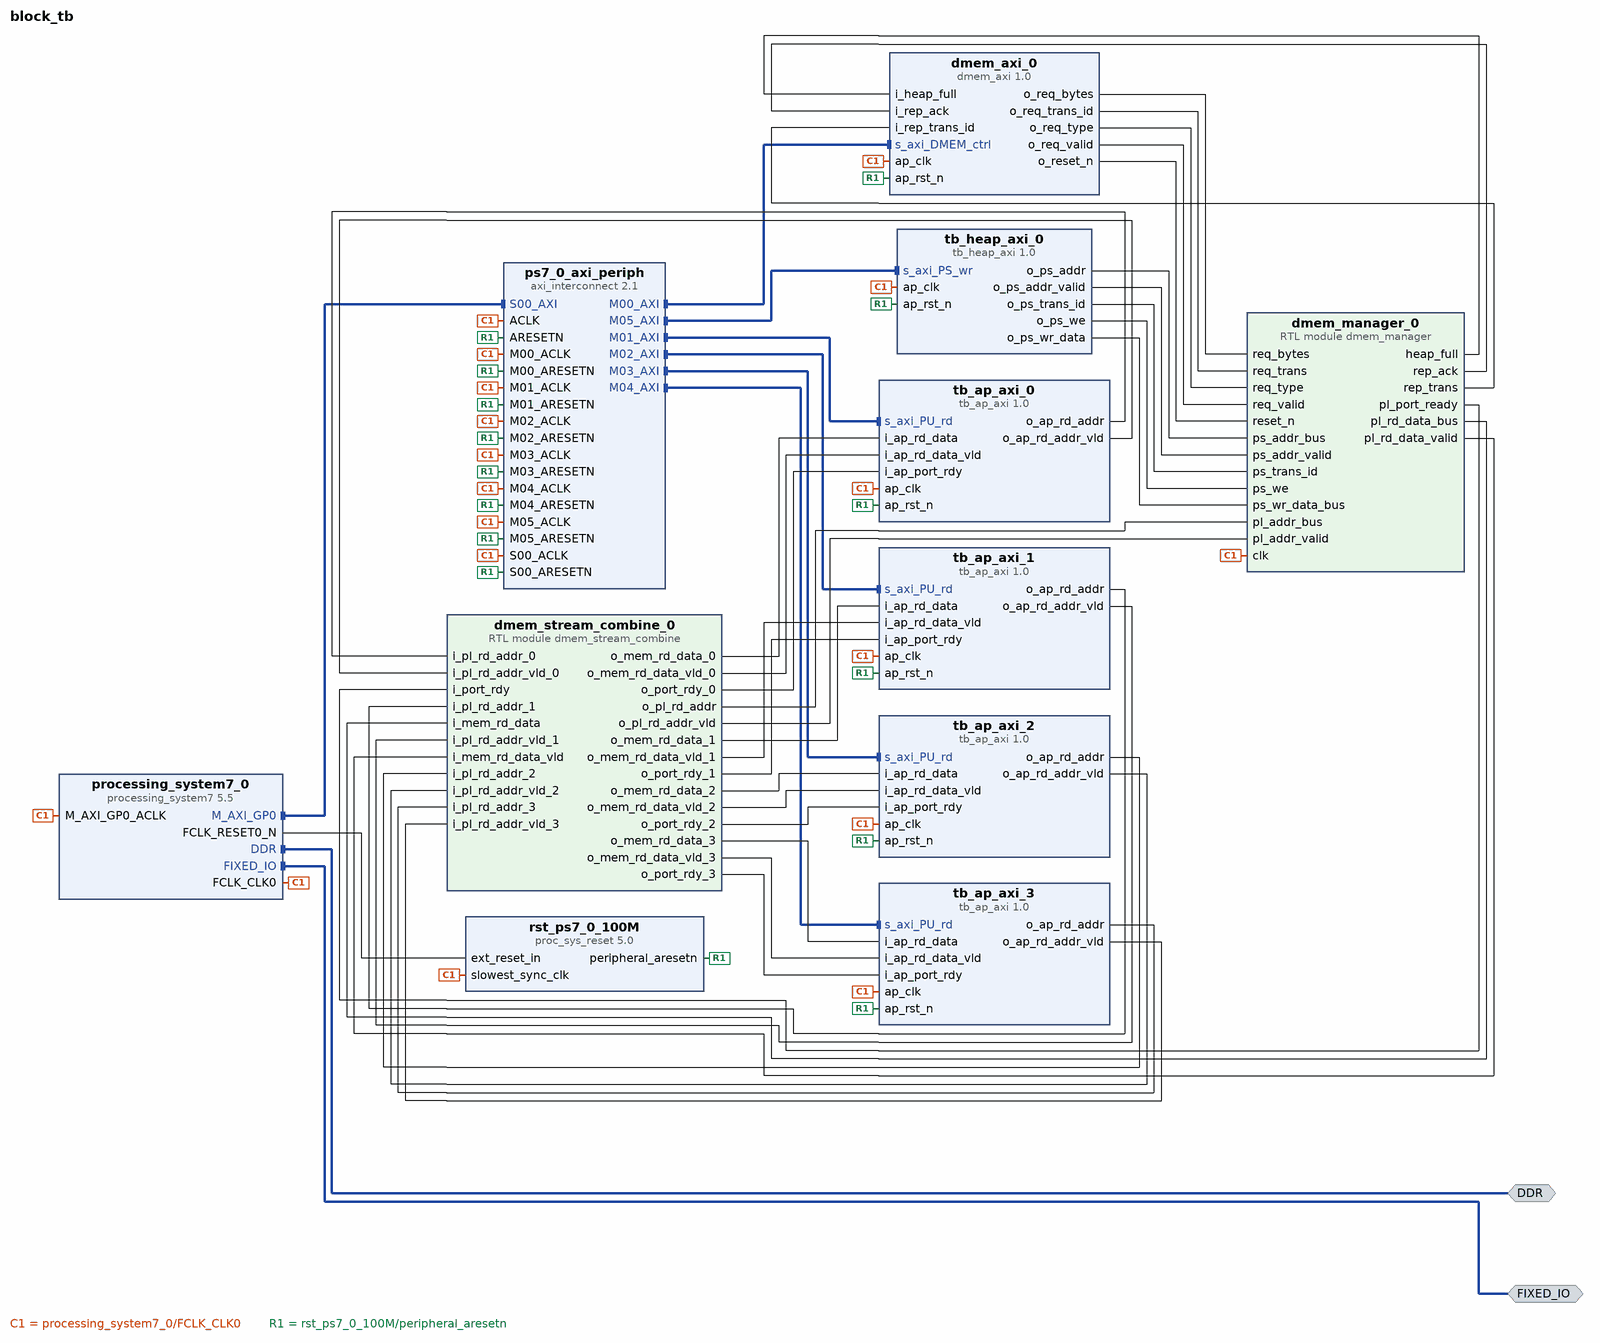
[diagram p0: block diagram of the top level]
# Vivado block design block_tb, xc7z020clg400-1, Vivado 2023.2
create_bd_design block_tb

create_bd_intf_port -mode Master -vlnv xilinx.com:interface:ddrx_rtl:1.0 DDR
create_bd_intf_port -mode Master -vlnv xilinx.com:display_processing_system7:fixedio_rtl:1.0 FIXED_IO

create_bd_cell -type module -reference dmem_manager dmem_manager_0
create_bd_cell -type ip -vlnv xilinx.com:hls:dmem_axi:1.0 dmem_axi_0
create_bd_cell -type ip -vlnv xilinx.com:hls:tb_heap_axi:1.0 tb_heap_axi_0
create_bd_cell -type module -reference dmem_stream_combine dmem_stream_combine_0
create_bd_cell -type ip -vlnv xilinx.com:hls:tb_ap_axi:1.0 tb_ap_axi_0
create_bd_cell -type ip -vlnv xilinx.com:hls:tb_ap_axi:1.0 tb_ap_axi_1
create_bd_cell -type ip -vlnv xilinx.com:hls:tb_ap_axi:1.0 tb_ap_axi_2
create_bd_cell -type ip -vlnv xilinx.com:hls:tb_ap_axi:1.0 tb_ap_axi_3
create_bd_cell -type ip -vlnv xilinx.com:ip:processing_system7:5.5 processing_system7_0
set_property -dict [list \
  CONFIG.PCW_APU_PERIPHERAL_FREQMHZ 650 \
  CONFIG.PCW_CRYSTAL_PERIPHERAL_FREQMHZ 50 \
  CONFIG.PCW_ENET0_ENET0_IO {MIO 16 .. 27} \
  CONFIG.PCW_ENET0_GRP_MDIO_ENABLE 1 \
  CONFIG.PCW_ENET0_GRP_MDIO_IO {MIO 52 .. 53} \
  CONFIG.PCW_ENET0_PERIPHERAL_ENABLE 1 \
  CONFIG.PCW_ENET0_RESET_ENABLE 1 \
  CONFIG.PCW_ENET0_RESET_IO {MIO 9} \
  CONFIG.PCW_ENET_RESET_ENABLE 1 \
  CONFIG.PCW_ENET_RESET_SELECT {Share reset pin} \
  CONFIG.PCW_FPGA0_PERIPHERAL_FREQMHZ 100 \
  CONFIG.PCW_FPGA1_PERIPHERAL_FREQMHZ 50 \
  CONFIG.PCW_GPIO_MIO_GPIO_ENABLE 1 \
  CONFIG.PCW_GPIO_MIO_GPIO_IO MIO \
  CONFIG.PCW_I2C_RESET_ENABLE 1 \
  CONFIG.PCW_M_AXI_GP0_FREQMHZ 10 \
  CONFIG.PCW_PERIPHERAL_BOARD_PRESET None \
  CONFIG.PCW_PRESET_BANK1_VOLTAGE {LVCMOS 1.8V} \
  CONFIG.PCW_QSPI_GRP_FBCLK_ENABLE 1 \
  CONFIG.PCW_QSPI_GRP_FBCLK_IO {MIO 8} \
  CONFIG.PCW_QSPI_GRP_SINGLE_SS_ENABLE 1 \
  CONFIG.PCW_QSPI_GRP_SINGLE_SS_IO {MIO 1 .. 6} \
  CONFIG.PCW_QSPI_PERIPHERAL_ENABLE 1 \
  CONFIG.PCW_QSPI_QSPI_IO {MIO 1 .. 6} \
  CONFIG.PCW_SD0_GRP_CD_ENABLE 1 \
  CONFIG.PCW_SD0_GRP_CD_IO {MIO 47} \
  CONFIG.PCW_SD0_GRP_WP_ENABLE 0 \
  CONFIG.PCW_SD0_PERIPHERAL_ENABLE 1 \
  CONFIG.PCW_SD0_SD0_IO {MIO 40 .. 45} \
  CONFIG.PCW_SDIO_PERIPHERAL_FREQMHZ 50 \
  CONFIG.PCW_SINGLE_QSPI_DATA_MODE x4 \
  CONFIG.PCW_UART0_PERIPHERAL_ENABLE 1 \
  CONFIG.PCW_UART0_UART0_IO {MIO 14 .. 15} \
  CONFIG.PCW_UART1_PERIPHERAL_ENABLE 0 \
  CONFIG.PCW_UART_PERIPHERAL_FREQMHZ 100 \
  CONFIG.PCW_UIPARAM_DDR_BUS_WIDTH {16 Bit} \
  CONFIG.PCW_UIPARAM_DDR_FREQ_MHZ 525 \
  CONFIG.PCW_UIPARAM_DDR_PARTNO {MT41J256M16 RE-125} \
  CONFIG.PCW_USB0_PERIPHERAL_ENABLE 1 \
  CONFIG.PCW_USB0_RESET_ENABLE 1 \
  CONFIG.PCW_USB0_RESET_IO {MIO 46} \
  CONFIG.PCW_USB0_USB0_IO {MIO 28 .. 39} \
  CONFIG.PCW_USB_RESET_ENABLE 1 \
  CONFIG.PCW_USB_RESET_SELECT {Share reset pin} \
] [get_bd_cells processing_system7_0]
# 481 more settings of processing_system7_0 are not shown: defaults, MIO pin electricals, DDR timing, and values the tool derives
create_bd_cell -type ip -vlnv xilinx.com:ip:axi_interconnect:2.1 ps7_0_axi_periph
set_property -dict {CONFIG.NUM_MI 6} [get_bd_cells ps7_0_axi_periph]
create_bd_cell -type ip -vlnv xilinx.com:ip:proc_sys_reset:5.0 rst_ps7_0_100M

# ---- connections ----

connect_bd_intf_net [get_bd_intf_ports DDR] [get_bd_intf_pins processing_system7_0/DDR]
connect_bd_intf_net [get_bd_intf_ports FIXED_IO] [get_bd_intf_pins processing_system7_0/FIXED_IO]
connect_bd_intf_net [get_bd_intf_pins processing_system7_0/M_AXI_GP0] [get_bd_intf_pins ps7_0_axi_periph/S00_AXI]
connect_bd_intf_net [get_bd_intf_pins ps7_0_axi_periph/M00_AXI] [get_bd_intf_pins dmem_axi_0/s_axi_DMEM_ctrl]
connect_bd_intf_net [get_bd_intf_pins ps7_0_axi_periph/M01_AXI] [get_bd_intf_pins tb_ap_axi_0/s_axi_PU_rd]
connect_bd_intf_net [get_bd_intf_pins ps7_0_axi_periph/M02_AXI] [get_bd_intf_pins tb_ap_axi_1/s_axi_PU_rd]
connect_bd_intf_net [get_bd_intf_pins ps7_0_axi_periph/M03_AXI] [get_bd_intf_pins tb_ap_axi_2/s_axi_PU_rd]
connect_bd_intf_net [get_bd_intf_pins ps7_0_axi_periph/M04_AXI] [get_bd_intf_pins tb_ap_axi_3/s_axi_PU_rd]
connect_bd_intf_net [get_bd_intf_pins ps7_0_axi_periph/M05_AXI] [get_bd_intf_pins tb_heap_axi_0/s_axi_PS_wr]
connect_bd_net [get_bd_pins dmem_axi_0/o_req_bytes] [get_bd_pins dmem_manager_0/req_bytes]
connect_bd_net [get_bd_pins dmem_axi_0/o_req_trans_id] [get_bd_pins dmem_manager_0/req_trans]
connect_bd_net [get_bd_pins dmem_axi_0/o_req_type] [get_bd_pins dmem_manager_0/req_type]
connect_bd_net [get_bd_pins dmem_axi_0/o_req_valid] [get_bd_pins dmem_manager_0/req_valid]
connect_bd_net [get_bd_pins dmem_axi_0/o_reset_n] [get_bd_pins dmem_manager_0/reset_n]
connect_bd_net [get_bd_pins dmem_manager_0/heap_full] [get_bd_pins dmem_axi_0/i_heap_full]
connect_bd_net [get_bd_pins dmem_manager_0/pl_port_ready] [get_bd_pins dmem_stream_combine_0/i_port_rdy]
connect_bd_net [get_bd_pins dmem_manager_0/pl_rd_data_bus] [get_bd_pins dmem_stream_combine_0/i_mem_rd_data]
connect_bd_net [get_bd_pins dmem_manager_0/pl_rd_data_valid] [get_bd_pins dmem_stream_combine_0/i_mem_rd_data_vld]
connect_bd_net [get_bd_pins dmem_manager_0/rep_ack] [get_bd_pins dmem_axi_0/i_rep_ack]
connect_bd_net [get_bd_pins dmem_manager_0/rep_trans] [get_bd_pins dmem_axi_0/i_rep_trans_id]
connect_bd_net [get_bd_pins dmem_stream_combine_0/o_mem_rd_data_0] [get_bd_pins tb_ap_axi_0/i_ap_rd_data]
connect_bd_net [get_bd_pins dmem_stream_combine_0/o_mem_rd_data_1] [get_bd_pins tb_ap_axi_1/i_ap_rd_data]
connect_bd_net [get_bd_pins dmem_stream_combine_0/o_mem_rd_data_2] [get_bd_pins tb_ap_axi_2/i_ap_rd_data]
connect_bd_net [get_bd_pins dmem_stream_combine_0/o_mem_rd_data_3] [get_bd_pins tb_ap_axi_3/i_ap_rd_data]
connect_bd_net [get_bd_pins dmem_stream_combine_0/o_mem_rd_data_vld_0] [get_bd_pins tb_ap_axi_0/i_ap_rd_data_vld]
connect_bd_net [get_bd_pins dmem_stream_combine_0/o_mem_rd_data_vld_1] [get_bd_pins tb_ap_axi_1/i_ap_rd_data_vld]
connect_bd_net [get_bd_pins dmem_stream_combine_0/o_mem_rd_data_vld_2] [get_bd_pins tb_ap_axi_2/i_ap_rd_data_vld]
connect_bd_net [get_bd_pins dmem_stream_combine_0/o_mem_rd_data_vld_3] [get_bd_pins tb_ap_axi_3/i_ap_rd_data_vld]
connect_bd_net [get_bd_pins dmem_stream_combine_0/o_pl_rd_addr] [get_bd_pins dmem_manager_0/pl_addr_bus]
connect_bd_net [get_bd_pins dmem_stream_combine_0/o_pl_rd_addr_vld] [get_bd_pins dmem_manager_0/pl_addr_valid]
connect_bd_net [get_bd_pins dmem_stream_combine_0/o_port_rdy_0] [get_bd_pins tb_ap_axi_0/i_ap_port_rdy]
connect_bd_net [get_bd_pins dmem_stream_combine_0/o_port_rdy_1] [get_bd_pins tb_ap_axi_1/i_ap_port_rdy]
connect_bd_net [get_bd_pins dmem_stream_combine_0/o_port_rdy_2] [get_bd_pins tb_ap_axi_2/i_ap_port_rdy]
connect_bd_net [get_bd_pins dmem_stream_combine_0/o_port_rdy_3] [get_bd_pins tb_ap_axi_3/i_ap_port_rdy]
connect_bd_net [get_bd_pins processing_system7_0/FCLK_CLK0] \
  [get_bd_pins processing_system7_0/M_AXI_GP0_ACLK] [get_bd_pins ps7_0_axi_periph/S00_ACLK] \
  [get_bd_pins rst_ps7_0_100M/slowest_sync_clk] [get_bd_pins dmem_axi_0/ap_clk] [get_bd_pins ps7_0_axi_periph/M00_ACLK] \
  [get_bd_pins ps7_0_axi_periph/ACLK] [get_bd_pins ps7_0_axi_periph/M01_ACLK] [get_bd_pins ps7_0_axi_periph/M02_ACLK] \
  [get_bd_pins ps7_0_axi_periph/M03_ACLK] [get_bd_pins ps7_0_axi_periph/M04_ACLK] [get_bd_pins ps7_0_axi_periph/M05_ACLK] \
  [get_bd_pins tb_heap_axi_0/ap_clk] [get_bd_pins tb_ap_axi_0/ap_clk] [get_bd_pins tb_ap_axi_1/ap_clk] \
  [get_bd_pins tb_ap_axi_2/ap_clk] [get_bd_pins tb_ap_axi_3/ap_clk] [get_bd_pins dmem_manager_0/clk]
connect_bd_net [get_bd_pins processing_system7_0/FCLK_RESET0_N] [get_bd_pins rst_ps7_0_100M/ext_reset_in]
connect_bd_net [get_bd_pins rst_ps7_0_100M/peripheral_aresetn] \
  [get_bd_pins ps7_0_axi_periph/S00_ARESETN] [get_bd_pins dmem_axi_0/ap_rst_n] [get_bd_pins ps7_0_axi_periph/M00_ARESETN] \
  [get_bd_pins ps7_0_axi_periph/ARESETN] [get_bd_pins ps7_0_axi_periph/M01_ARESETN] \
  [get_bd_pins ps7_0_axi_periph/M02_ARESETN] [get_bd_pins ps7_0_axi_periph/M03_ARESETN] \
  [get_bd_pins ps7_0_axi_periph/M04_ARESETN] [get_bd_pins ps7_0_axi_periph/M05_ARESETN] [get_bd_pins tb_heap_axi_0/ap_rst_n] \
  [get_bd_pins tb_ap_axi_0/ap_rst_n] [get_bd_pins tb_ap_axi_1/ap_rst_n] [get_bd_pins tb_ap_axi_2/ap_rst_n] \
  [get_bd_pins tb_ap_axi_3/ap_rst_n]
connect_bd_net [get_bd_pins tb_ap_axi_0/o_ap_rd_addr] [get_bd_pins dmem_stream_combine_0/i_pl_rd_addr_0]
connect_bd_net [get_bd_pins tb_ap_axi_0/o_ap_rd_addr_vld] [get_bd_pins dmem_stream_combine_0/i_pl_rd_addr_vld_0]
connect_bd_net [get_bd_pins tb_ap_axi_1/o_ap_rd_addr] [get_bd_pins dmem_stream_combine_0/i_pl_rd_addr_1]
connect_bd_net [get_bd_pins tb_ap_axi_1/o_ap_rd_addr_vld] [get_bd_pins dmem_stream_combine_0/i_pl_rd_addr_vld_1]
connect_bd_net [get_bd_pins tb_ap_axi_2/o_ap_rd_addr] [get_bd_pins dmem_stream_combine_0/i_pl_rd_addr_2]
connect_bd_net [get_bd_pins tb_ap_axi_2/o_ap_rd_addr_vld] [get_bd_pins dmem_stream_combine_0/i_pl_rd_addr_vld_2]
connect_bd_net [get_bd_pins tb_ap_axi_3/o_ap_rd_addr] [get_bd_pins dmem_stream_combine_0/i_pl_rd_addr_3]
connect_bd_net [get_bd_pins tb_ap_axi_3/o_ap_rd_addr_vld] [get_bd_pins dmem_stream_combine_0/i_pl_rd_addr_vld_3]
connect_bd_net [get_bd_pins tb_heap_axi_0/o_ps_addr] [get_bd_pins dmem_manager_0/ps_addr_bus]
connect_bd_net [get_bd_pins tb_heap_axi_0/o_ps_addr_valid] [get_bd_pins dmem_manager_0/ps_addr_valid]
connect_bd_net [get_bd_pins tb_heap_axi_0/o_ps_trans_id] [get_bd_pins dmem_manager_0/ps_trans_id]
connect_bd_net [get_bd_pins tb_heap_axi_0/o_ps_we] [get_bd_pins dmem_manager_0/ps_we]
connect_bd_net [get_bd_pins tb_heap_axi_0/o_ps_wr_data] [get_bd_pins dmem_manager_0/ps_wr_data_bus]

# ---- address map ----
assign_bd_address -offset 0x40000000 -range 64K -target_address_space [get_bd_addr_spaces processing_system7_0/Data] [get_bd_addr_segs dmem_axi_0/s_axi_DMEM_ctrl/Reg]
assign_bd_address -offset 0x40010000 -range 64K -target_address_space [get_bd_addr_spaces processing_system7_0/Data] [get_bd_addr_segs tb_ap_axi_0/s_axi_PU_rd/Reg]
assign_bd_address -offset 0x40020000 -range 64K -target_address_space [get_bd_addr_spaces processing_system7_0/Data] [get_bd_addr_segs tb_ap_axi_1/s_axi_PU_rd/Reg]
assign_bd_address -offset 0x40030000 -range 64K -target_address_space [get_bd_addr_spaces processing_system7_0/Data] [get_bd_addr_segs tb_ap_axi_2/s_axi_PU_rd/Reg]
assign_bd_address -offset 0x40040000 -range 64K -target_address_space [get_bd_addr_spaces processing_system7_0/Data] [get_bd_addr_segs tb_ap_axi_3/s_axi_PU_rd/Reg]
assign_bd_address -offset 0x40050000 -range 64K -target_address_space [get_bd_addr_spaces processing_system7_0/Data] [get_bd_addr_segs tb_heap_axi_0/s_axi_PS_wr/Reg]

validate_bd_design
save_bd_design
